# Altium schematic sheet Main.SchDoc
size A4
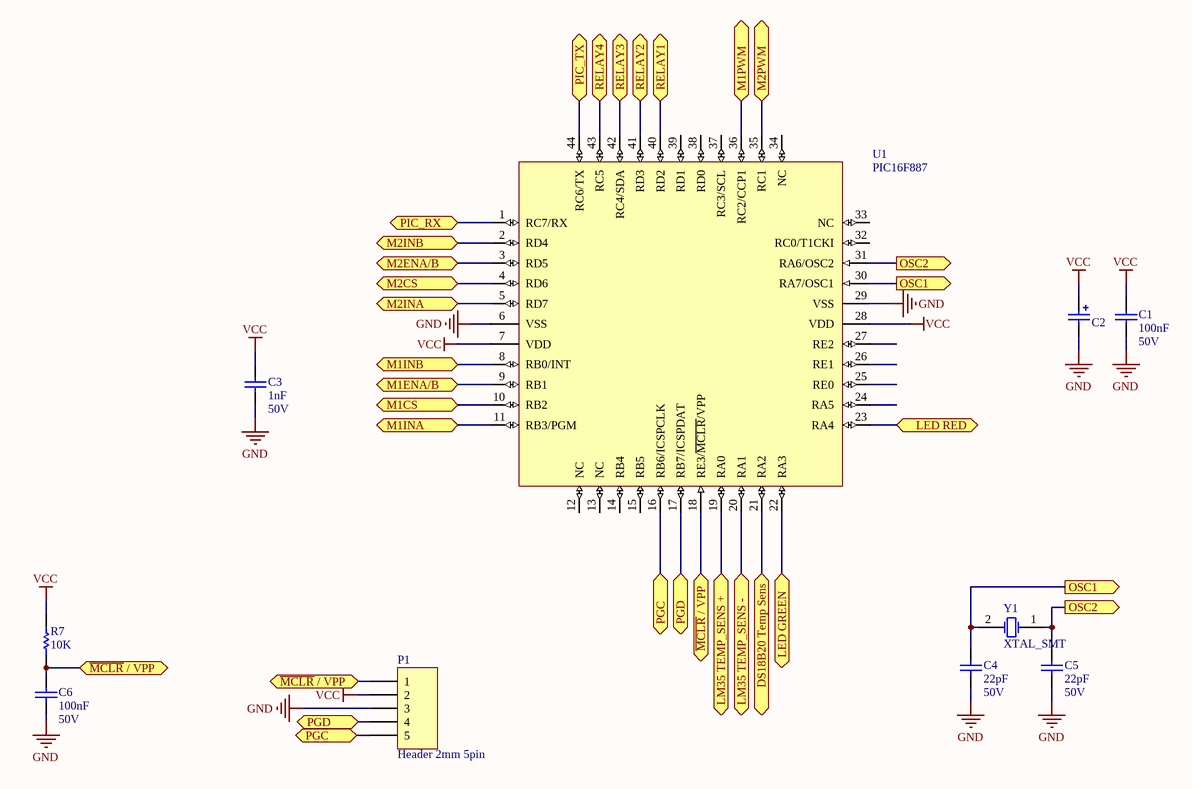
[diagram p0: Main.SchDoc]

## Parts
C1  value 100nF  Voltage: 50V  [3-0603_L]  (hidden comment: Cap)
C2  CAP-Tantal  [3528]  (value not drawn)
C3  value 1nF  Voltage: 50V  [3-0603_L]  (hidden comment: Cap)
C4  value 22pF  Voltage: 50V  [3-0603_L]  (hidden comment: Cap)
C5  value 22pF  Voltage: 50V  [3-0603_L]  (hidden comment: Cap)
C6  value 100nF  Voltage: 50V  [3-0603_L]  (hidden comment: Cap)
P1  Header 2mm 5pin  [Header 2mm 5Pin]
R7  value 10K  [3-0603_L]  (hidden comment: Res1)
U1  PIC16F887  [TQFP-44]
Y1  XTAL_SMT  [XTAL - SMT]

## Ports
DS18B20 Temp Sens (bidir), LED GREEN (bidir), LED RED (bidir), LM35 TEMP_SENS + (bidir), LM35 TEMP_SENS - (bidir), M1CS, M1ENA/B, M1INA, M1INB, M1PWM, M2CS, M2ENA/B, M2INA, M2INB, M2PWM, OSC1 (out), OSC2 (out), PGC (bidir), PGD (bidir), PIC_RX (bidir), PIC_TX (bidir), RELAY1 (bidir), RELAY2 (bidir), RELAY3 (bidir), RELAY4 (bidir), ~{MCLR} / VPP (bidir)

## Nets
GND: C1.1 C2.2 C3.1 C4.1 C5.1 C6.1 P1.3 U1.6(VSS) U1.29(VSS)
VCC: C1.2 C2.1 C3.2 P1.2 R7.2 U1.7(VDD) U1.28(VDD)
~{MCLR} / VPP: C6.2 P1.1 R7.1 U1.18(RE3/~{MCLR}/VPP) ; port ~{MCLR} / VPP
DS18B20 Temp Sens: U1.21(RA2) ; port DS18B20 Temp Sens
LED GREEN: U1.22(RA3) ; port LED GREEN
LED RED: U1.23(RA4) ; port LED RED
LM35 TEMP_SENS +: U1.19(RA0) ; port LM35 TEMP_SENS +
LM35 TEMP_SENS -: U1.20(RA1) ; port LM35 TEMP_SENS -
M1CS: U1.10(RB2) ; port M1CS
M1ENA/B: U1.9(RB1) ; port M1ENA/B
M1INA: U1.11(RB3/PGM) ; port M1INA
M1INB: U1.8(RB0/INT) ; port M1INB
M1PWM: U1.36(RC2/CCP1) ; port M1PWM
M2CS: U1.4(RD6) ; port M2CS
M2ENA/B: U1.3(RD5) ; port M2ENA/B
M2INA: U1.5(RD7) ; port M2INA
M2INB: U1.2(RD4) ; port M2INB
M2PWM: U1.35(RC1) ; port M2PWM
OSC1: C4.2 U1.30(RA7/OSC1) Y1.2(OSC2) ; port OSC1
OSC2: C5.2 U1.31(RA6/OSC2) Y1.1(OSC1) ; port OSC2
PGC: P1.5 U1.16(RB6/ICSPCLK) ; port PGC
PGD: P1.4 U1.17(RB7/ICSPDAT) ; port PGD
PIC_RX: U1.1(RC7/RX) ; port PIC_RX
PIC_TX: U1.44(RC6/TX) ; port PIC_TX
RELAY1: U1.40(RD2) ; port RELAY1
RELAY2: U1.41(RD3) ; port RELAY2
RELAY3: U1.42(RC4/SDA) ; port RELAY3
RELAY4: U1.43(RC5) ; port RELAY4

Not connected (* = marked no-connect by the designer): U1 12(NC) 13(NC) 14(RB4) 15(RB5) 24(RA5) 25(RE0) 26(RE1) 27(RE2) 32(RC0/T1CKI) 33(NC) 34(NC) 37(RC3/SCL) 38(RD0) 39(RD1)

## Library data of the parts
C1 C3-C6 = Cap: Capacitor; Published: 8-Jun-2000; Revision: July-2002: Re-released for DXP Platform.; Publisher: Altium Limited
C2 = CAP-Tantal: Tantamount Military, Surface Mount MIL-PRF-55365/8 Qualified Solid Tantalum Chip Capacitor: 6.8uF, 20% Tolerance, 6 WVDC @ +85°C, Surge = 8V; Note: See Data Sheet for full range of components; Value: 22uF; Voltage: 10V; Published: 19-Mar-2004; DatasheetDocument: 20-Mar-2003; PackageReference: 3528; Publisher: Altium Limited; Code_JEITA: 3528; ComponentLink1Description: Manufacturer Link; ComponentLink1URL: http://www.vishay.com/; ComponentLink2Description: Datasheet; ComponentLink2URL: http://www.vishay.com/docs/40011/cwr11.pdf
P1 = Header 2mm 5pin: Header 2mm , 5-Pin; LatestRevisionDate: 17-Jul-2002; LatestRevisionNote: Re-released for DXP Platform.; Publisher: Altium Limited
R7 = Res1: Resistor; Published: 8-Jun-2000; LatestRevisionDate: 17-Jul-2002; LatestRevisionNote: Re-released for DXP Platform.; PackageReference: AXIAL-0.3; Publisher: Altium Limited
U1 = PIC16F887: EPROM-Based 8-Bit CMOS Microcontroller; Package Information: Latest Revision: 1998; Published: 8-Jun-2000; Revision: 17-Jul-2002: Re-released for DXP Platform.; Datasheet: Latest Revision: 1998; Package Reference: JW18; Publisher: Altium Limited
Y1 = XTAL_SMT: Crystal Oscillator; Value: 20MHz; Published: 8-Jun-2000; LatestRevisionDate: 17-Jul-2002; LatestRevisionNote: Re-released for DXP Platform.; PackageReference: R38; Publisher: Altium Limited